# EAGLE design M882 (EAGLE 6.6.0)
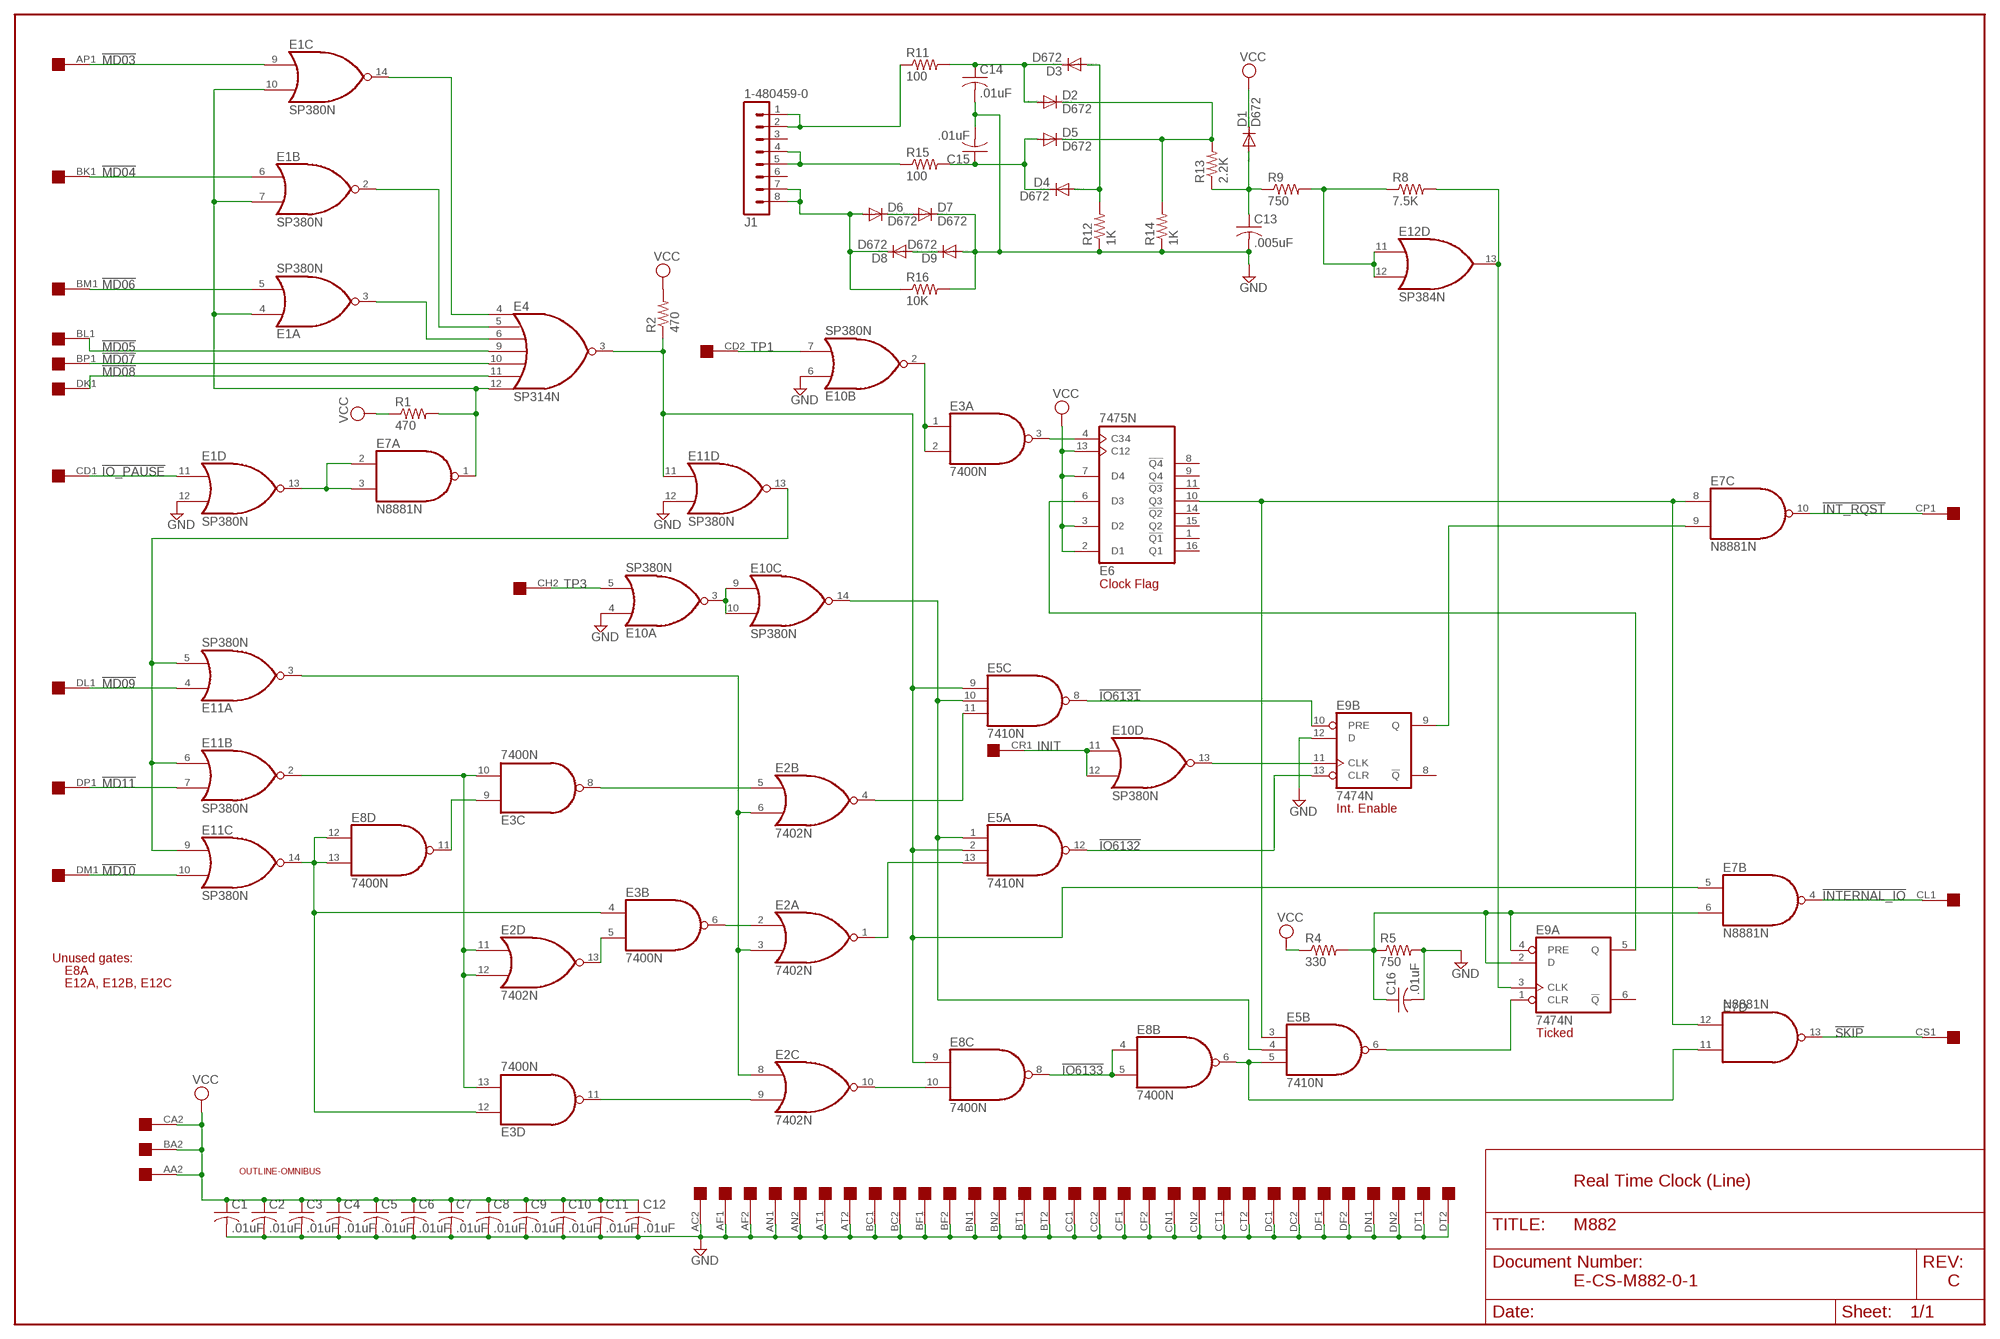
[diagram p0: schematic, sheet 1]

## Parts
C1  .01uF  C-US050-025X075  [C050-025X075]
C2  .01uF  C-US050-025X075  [C050-025X075]
C3  .01uF  C-US050-025X075  [C050-025X075]
C4  .01uF  C-US050-025X075  [C050-025X075]
C5  .01uF  C-US050-025X075  [C050-025X075]
C6  .01uF  C-US050-025X075  [C050-025X075]
C7  .01uF  C-US050-025X075  [C050-025X075]
C8  .01uF  C-US050-025X075  [C050-025X075]
C9  .01uF  C-US050-025X075  [C050-025X075]
C10  .01uF  C-US050-025X075  [C050-025X075]
C11  .01uF  C-US050-025X075  [C050-025X075]
C12  .01uF  C-US050-025X075  [C050-025X075]
C13  .005uF  C-US050-025X075  [C050-025X075]
C14  .01uF  C-US050-025X075  [C050-025X075]
C15  .01uF  C-US050-025X075  [C050-025X075]
C16  .01uF  C-US050-025X075  [C050-025X075]
D1  D672  1N4148DO35-10  [DO35-10]
D2  D672  1N4148DO35-10  [DO35-10]
D3  D672  1N4148DO35-10  [DO35-10]
D4  D672  1N4148DO35-10  [DO35-10]
D5  D672  1N4148DO35-10  [DO35-10]
D6  D672  1N4148DO35-10  [DO35-10]
D7  D672  1N4148DO35-10  [DO35-10]
D8  D672  1N4148DO35-10  [DO35-10]
D9  D672  1N4148DO35-10  [DO35-10]
E1  SP380N  [DIL14]
E2  7402N  [DIL14]
E3  7400N  [DIL14]
E4  SP314N  [DIL14]
E5  7410N  [DIL14]
E6  7475N  [DIL16]
E7  N8881N  [DIL14]
E8  7400N  [DIL14]
E9  7474N  74S74N  [DIL14]
E10  SP380N  [DIL14]
E11  SP380N  [DIL14]
E12  SP384N  [DIL14]
EDGE  QUAD  [EDGE-CON8]
J1  1-480459-0  [1-480459-0]
R1  470  R-US_0207/10  [0207/10]
R2  470  R-US_0207/10  [0207/10]
R4  330  R-US_0207/10  [0207/10]
R5  750  R-US_0207/10  [0207/10]
R8  7.5K  R-US_0207/10  [0207/10]
R9  750  R-US_0207/10  [0207/10]
R11  100  R-US_0207/10  [0207/10]
R12  1K  R-US_0207/10  [0207/10]
R13  2.2K  R-US_0207/10  [0207/10]
R14  1K  R-US_0207/10  [0207/10]
R15  100  R-US_0207/10  [0207/10]
R16  10K  R-US_0207/10  [0207/10]
U$1  OUTLINE-OMNIBUS  [OMNIBUS]

## Nets
!BIOPAUSE: E1.4(A:I0) E1.7(B:I1) E1.10(C:I1) E4.12(I6) E7.1(A:O) R1.2
!DO_CLSK: E5.6(B:O) E9.1(A:CLR)
!INIT: E9.11(B:CLK) E10.13(D:O)
!INT_RQST: E7.10(C:O) EDGE.CP1
!INTERNAL_IO: E7.4(B:O) EDGE.CL1
!IO6131: E5.8(C:O) E9.10(B:PRE)
!IO6132: E5.12(A:O) E9.13(B:CLR)
!IO6133: E8.4(B:I0) E8.5(B:I1) E8.8(C:O)
!IO_PAUSE: E1.11(D:I0) EDGE.CD1
!MAYBE_CLEI: E2.5(B:I0) E3.8(C:O)
!MAYBE_CLSK: E2.9(C:I1) E3.11(D:O)
!MAYBECLDI: E2.2(A:I0) E3.6(B:O)
!MD03: E1.9(C:I0) EDGE.AP1
!MD04: E1.6(B:I0) EDGE.BK1
!MD05: E4.9(I3) EDGE.BL1
!MD06: E1.5(A:I1) EDGE.BM1
!MD07: E4.10(I4) EDGE.BP1
!MD08: E4.11(I5) EDGE.DK1
!MD09: E11.4(A:I0) EDGE.DL1
!MD10: E11.10(C:I1) EDGE.DM1
!MD11: E11.7(B:I1) EDGE.DP1
!MYIOT: E11.5(A:I1) E11.6(B:I0) E11.9(C:I0) E11.13(D:O)
!MYMD10: E3.9(C:I0) E8.11(D:O)
!MYMD11: E2.13(D:O) E3.5(B:I1)
!SKIP: E7.13(D:O) EDGE.CS1
!TP1: E3.1(A:I0) E3.2(A:I1) E10.2(B:O)
!TP3: E10.3(A:O) E10.9(C:I0) E10.10(C:I1)
+3V3: C16.1 E7.6(B:I1) E9.2(A:D) E9.4(A:PRE) R4.2 R5.1
BOSCIN: E9.3(A:CLK) E12.13(D:O) R8.2
BTP1: E3.3(A:O) E6.4(C34)
BTP3: E5.1(A:I0) E5.4(B:I1) E5.10(C:I1) E10.14(C:O)
CK_FLAG: E5.3(B:I0) E6.10(Q3) E7.8(C:I0) E7.12(D:I1)
CLDI: E2.1(A:O) E5.13(A:I2)
CLIE: E2.4(B:O) E5.11(C:I2)
CLSK: E2.10(C:O) E8.10(C:I1)
GND: C1.2 C2.2 C3.2 C4.2 C5.2 C6.2 C7.2 C8.2 C9.2 C10.2 C11.2 C12.2 C13.2 C14.2 C15.2 C16.2 D7.C D9.A E1.12(D:I1) E9.12(B:D) E10.4(A:I0) E10.6(B:I0) E11.12(D:I1) EDGE.AC2 EDGE.AF1 EDGE.AF2 EDGE.AN1 EDGE.AN2 EDGE.AT1 EDGE.AT2 EDGE.BC1 EDGE.BC2 EDGE.BF1 EDGE.BF2 EDGE.BN1 EDGE.BN2 EDGE.BT1 EDGE.BT2 EDGE.CC1 EDGE.CC2 EDGE.CF1 EDGE.CF2 EDGE.CN1 EDGE.CN2 EDGE.CT1 EDGE.CT2 EDGE.DC1 EDGE.DC2 EDGE.DF1 EDGE.DF2 EDGE.DN1 EDGE.DN2 EDGE.DT1 EDGE.DT2 R5.2 R12.1 R14.1 R16.2
INIT: E10.11(D:I0) E10.12(D:I1) EDGE.CR1
IO6133: E5.5(B:I2) E7.11(D:I0) E8.6(B:O)
IO_PAUSE: E1.13(D:O) E7.2(A:I0) E7.3(A:I1)
IOPMD03: E1.14(C:O) E4.4(I0)
IOPMD04: E1.2(B:O) E4.5(I1)
IOPMD06: E1.3(A:O) E4.6(I2)
IRQ_ENABLE: E7.9(C:I1) E9.9(B:Q)
MYIOT: E4.3(O) E5.2(A:I1) E5.9(C:I0) E7.5(B:I0) E8.9(C:I0) E11.11(D:I0) R2.1
MYMD09: E2.3(A:I1) E2.6(B:I1) E2.8(C:I0) E11.3(A:O)
MYMD10: E3.4(B:I0) E3.12(D:I0) E8.12(D:I0) E8.13(D:I1) E11.14(C:O)
MYMD11: E2.11(D:I0) E2.12(D:I1) E3.10(C:I1) E3.13(D:I1) E11.2(B:O)
N$9: J1.1 J1.2 R11.1
N$12: J1.4 J1.5 R15.1
N$20: D6.A D8.C J1.7 J1.8 R16.1
N$48: D6.C D7.A
N$52: D8.A D9.C
N$55: D2.C D5.C R13.2 R14.2
N$56: C14.1 D2.A D3.C R11.2
N$57: D3.A D4.A R12.2
N$58: C13.1 D1.A R9.1 R13.1
N$62: C15.1 D4.C D5.A R15.2
OSCIN: E12.11(D:I0) E12.12(D:I1) R8.1 R9.2
TICKED: E6.6(D3) E9.5(A:Q)
TP1: E10.7(B:I1) EDGE.CD2
TP3: E10.5(A:I1) EDGE.CH2
VCC: C1.1 C2.1 C3.1 C4.1 C5.1 C6.1 C7.1 C8.1 C9.1 C10.1 C11.1 C12.1 D1.C E6.2(D1) E6.3(D2) E6.7(D4) E6.13(C12) EDGE.AA2 EDGE.BA2 EDGE.CA2 R1.1 R2.2 R4.1
Unconnected: E6.1(!Q1) E6.8(!Q4) E6.9(Q4) E6.11(!Q3) E6.14(!Q2) E6.15(Q2) E6.16(Q1) E8.1(A:I0) E8.2(A:I1) E8.3(A:O) E9.6(A:!Q) E9.8(B:!Q) E12.2(B:O) E12.3(A:O) E12.4(A:I0) E12.5(A:I1) E12.6(B:I0) E12.7(B:I1) E12.9(C:I0) E12.10(C:I1) E12.14(C:O) EDGE.AA1 EDGE.AB1 EDGE.AB2 EDGE.AC1 EDGE.AD1 EDGE.AD2 EDGE.AE1 EDGE.AE2 EDGE.AH1 EDGE.AH2 EDGE.AJ1 EDGE.AJ2 EDGE.AK1 EDGE.AK2 EDGE.AL1 EDGE.AL2 EDGE.AM1 EDGE.AM2 EDGE.AP2 EDGE.AR1 EDGE.AR2 EDGE.AS1 EDGE.AS2 EDGE.AU1 EDGE.AU2 EDGE.AV1 EDGE.AV2 EDGE.BA1 EDGE.BB1 EDGE.BB2 EDGE.BD1 EDGE.BD2 EDGE.BE1 EDGE.BE2 EDGE.BH1 EDGE.BH2 EDGE.BJ1 EDGE.BJ2 EDGE.BK2 EDGE.BL2 EDGE.BM2 EDGE.BP2 EDGE.BR1 EDGE.BR2 EDGE.BS1 EDGE.BS2 EDGE.BU1 EDGE.BU2 EDGE.BV1 EDGE.BV2 EDGE.CA1 EDGE.CB1 EDGE.CB2 EDGE.CE1 EDGE.CE2 EDGE.CH1 EDGE.CJ1 EDGE.CJ2 EDGE.CK1 EDGE.CK2 EDGE.CL2 EDGE.CM1 EDGE.CM2 EDGE.CP2 EDGE.CR2 EDGE.CS2 EDGE.CU1 EDGE.CU2 EDGE.CV1 EDGE.CV2 EDGE.DA1 EDGE.DA2 EDGE.DB1 EDGE.DB2 EDGE.DD1 EDGE.DD2 EDGE.DE1 EDGE.DE2 EDGE.DH1 EDGE.DH2 EDGE.DJ1 EDGE.DJ2 EDGE.DK2 EDGE.DL2 EDGE.DM2 EDGE.DP2 EDGE.DR1 EDGE.DR2 EDGE.DS1 EDGE.DS2 EDGE.DU1 EDGE.DU2 EDGE.DV1 EDGE.DV2 J1.3 J1.6

## Notes on the sheet
- Clock Flag
- Int. Enable
- Unused gates:
- E8A
- E12A, E12B, E12C
- Ticked
- Real Time Clock (Line)
- E-CS-M882-0-1 | C

## Power pins joined to a net without a drawn wire
GND: E1.1(P:GND) E2.7(P:GND) E3.7(P:GND) E4.1(GND) E5.7(P:GND) E6.12(GND) E7.7(P:GND) E8.7(P:GND) E9.7(P:GND) E10.1(P:GND) E11.1(P:GND) E12.1(GND)
VCC: E1.8(P:VCC) E2.14(P:VCC) E3.14(P:VCC) E4.8(VCC) E5.14(P:VCC) E6.5(VCC) E7.14(P:VCC) E8.14(P:VCC) E9.14(P:VCC) E10.8(P:VCC) E11.8(P:VCC) E12.8(VCC)

## Library data of the parts
C1-C16 = rcl:C-US: CAPACITOR, American symbol
D1-D9 = diode:1N4148: DIODE high speed (Philips)
E1 E10 E11 = dec-con:SP380: Quad NOR gate (use 8640)
E2 = 74xx-us:74*02: Quad 2-input NOR gate
E3 E8 = 74xx-us:74*00: Quad 2-input NAND gate
E4 = dec-con:SP314: 7-Input NOR gate
E5 = 74xx-us:74*10: Triple 3-input NAND gate
E6 = 74xx-us:74*75: 4-bit bistable LATCH
E7 = dec-con:N8881: Quad 2-input NAND gate, open collector
E9 = 74xx-us:74*74: Dual D type positive edge triggered FLIP FLOP, preset and clear
E12 = dec-con:SP384: Quad OR gate
EDGE = dec-con:QUAD: Quad-Height DEC board
J1 = dec-con:1-480459-0: Mate-N-Lok 1-480459-0, board mounted.
R1 R2 R4 R5 R8 R9 R11-R16 = rcl:R-US_: RESISTOR, American symbol
U$1 = dec-con:OUTLINE-*: Board outlines for DEC boards.

## Net classes
0 default: width 0.813 mm

## Board
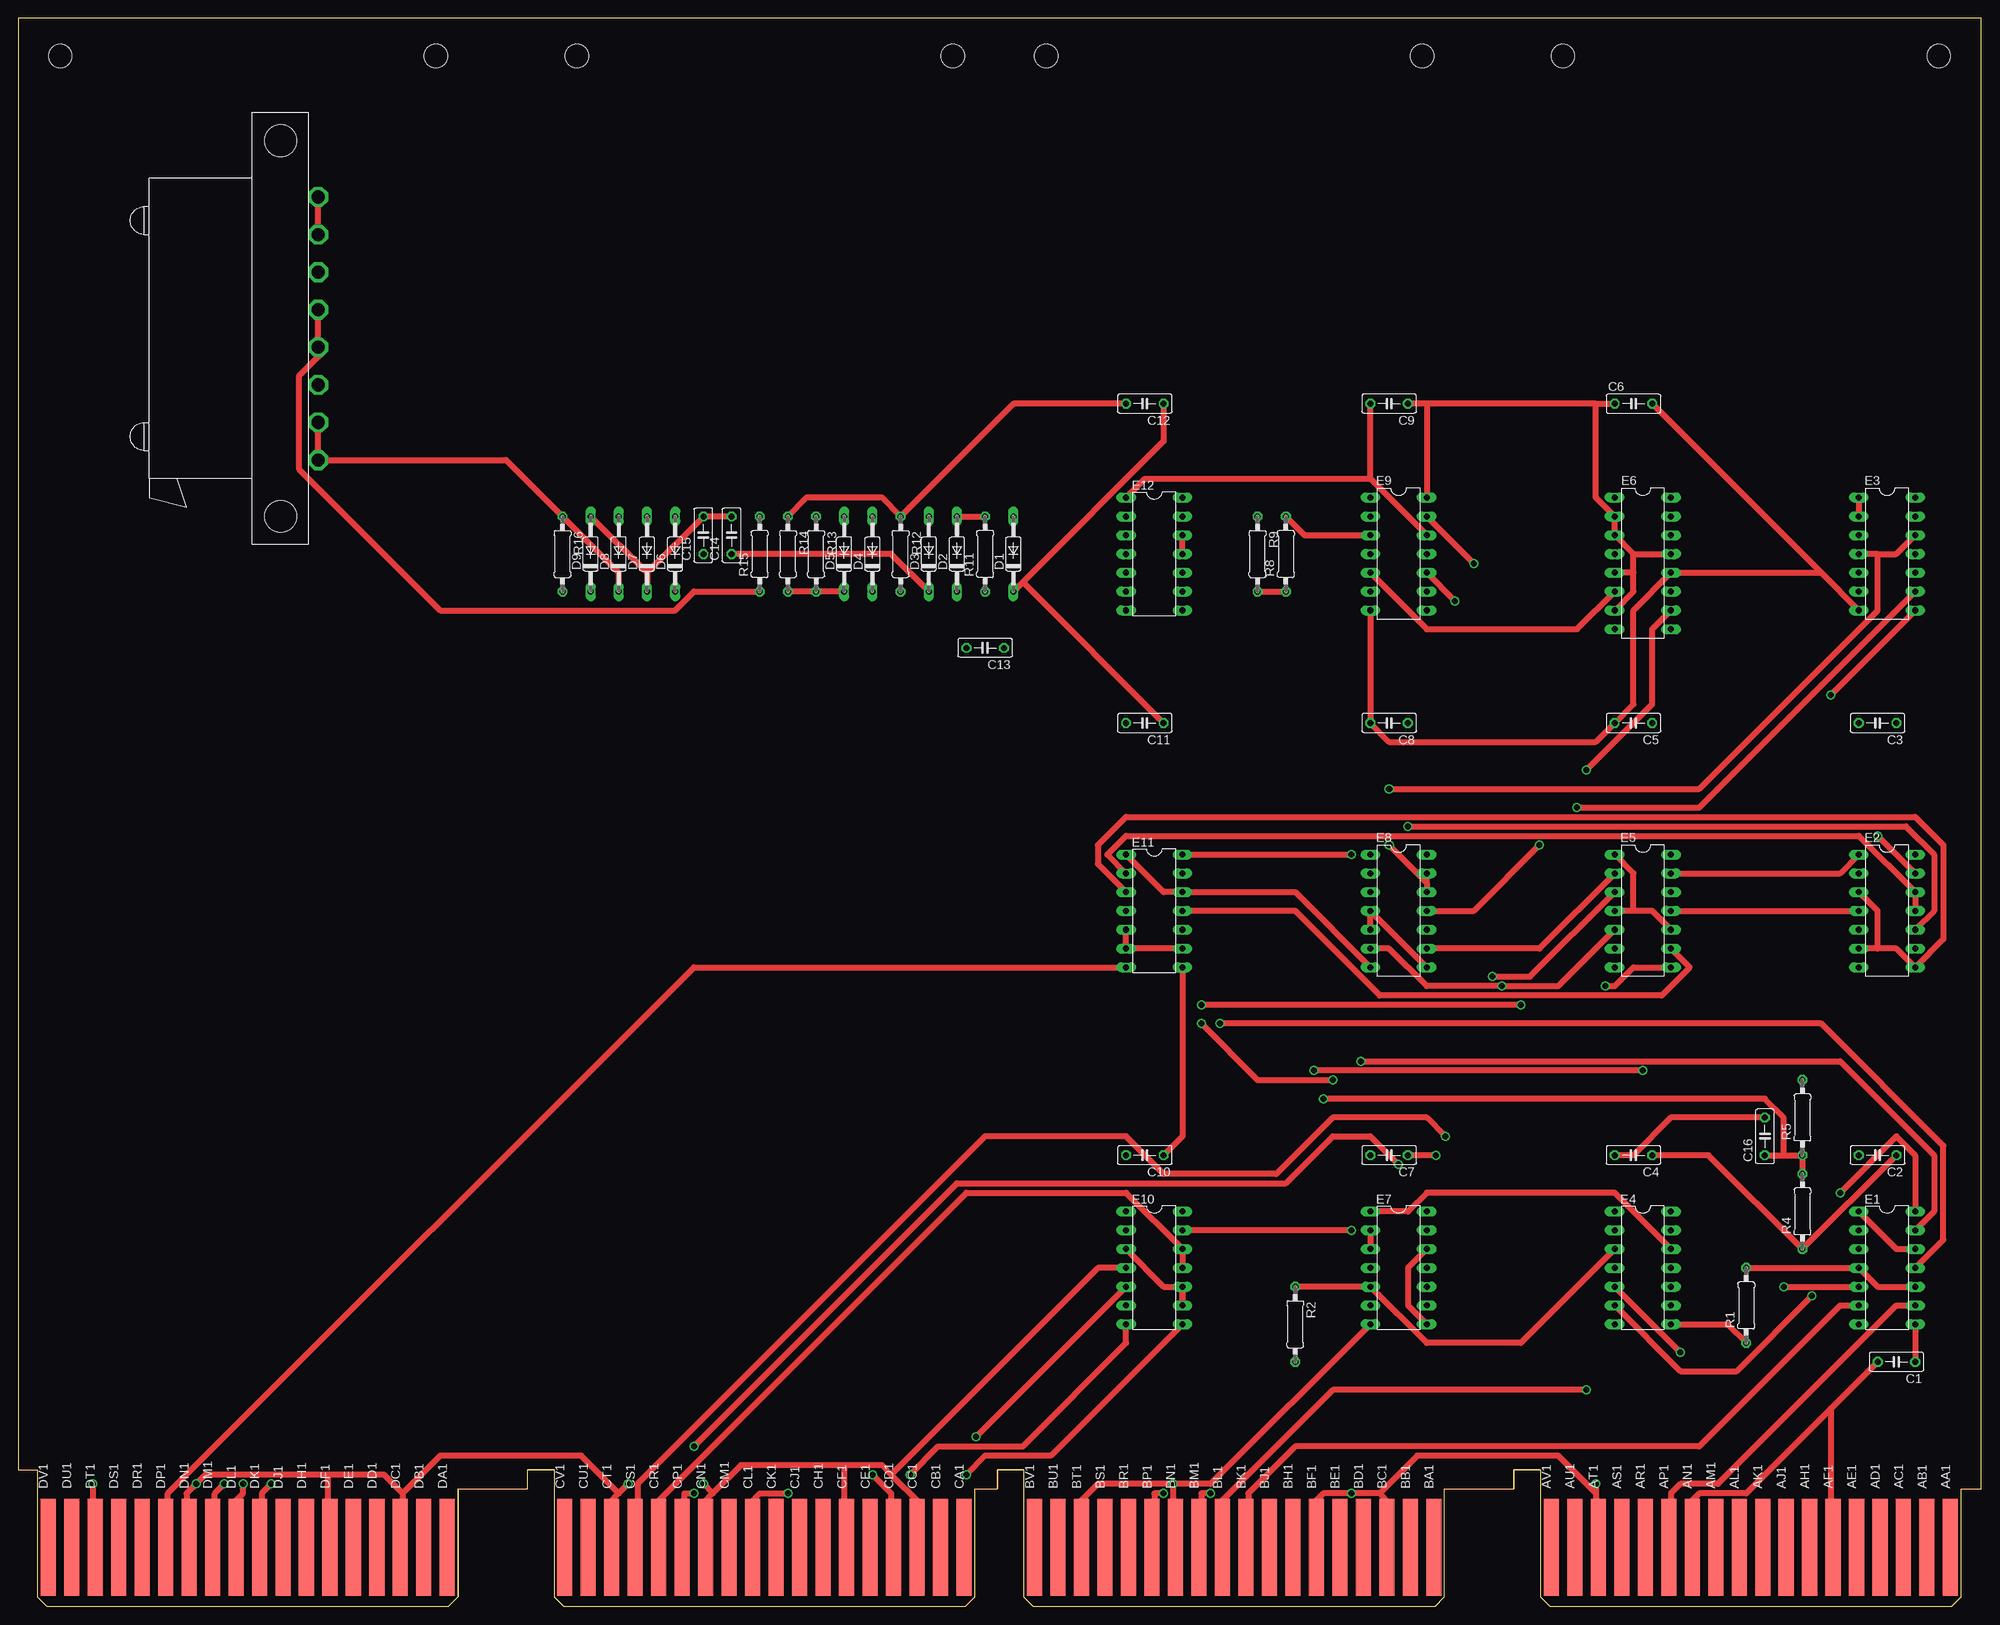
[diagram p1: board, top side]
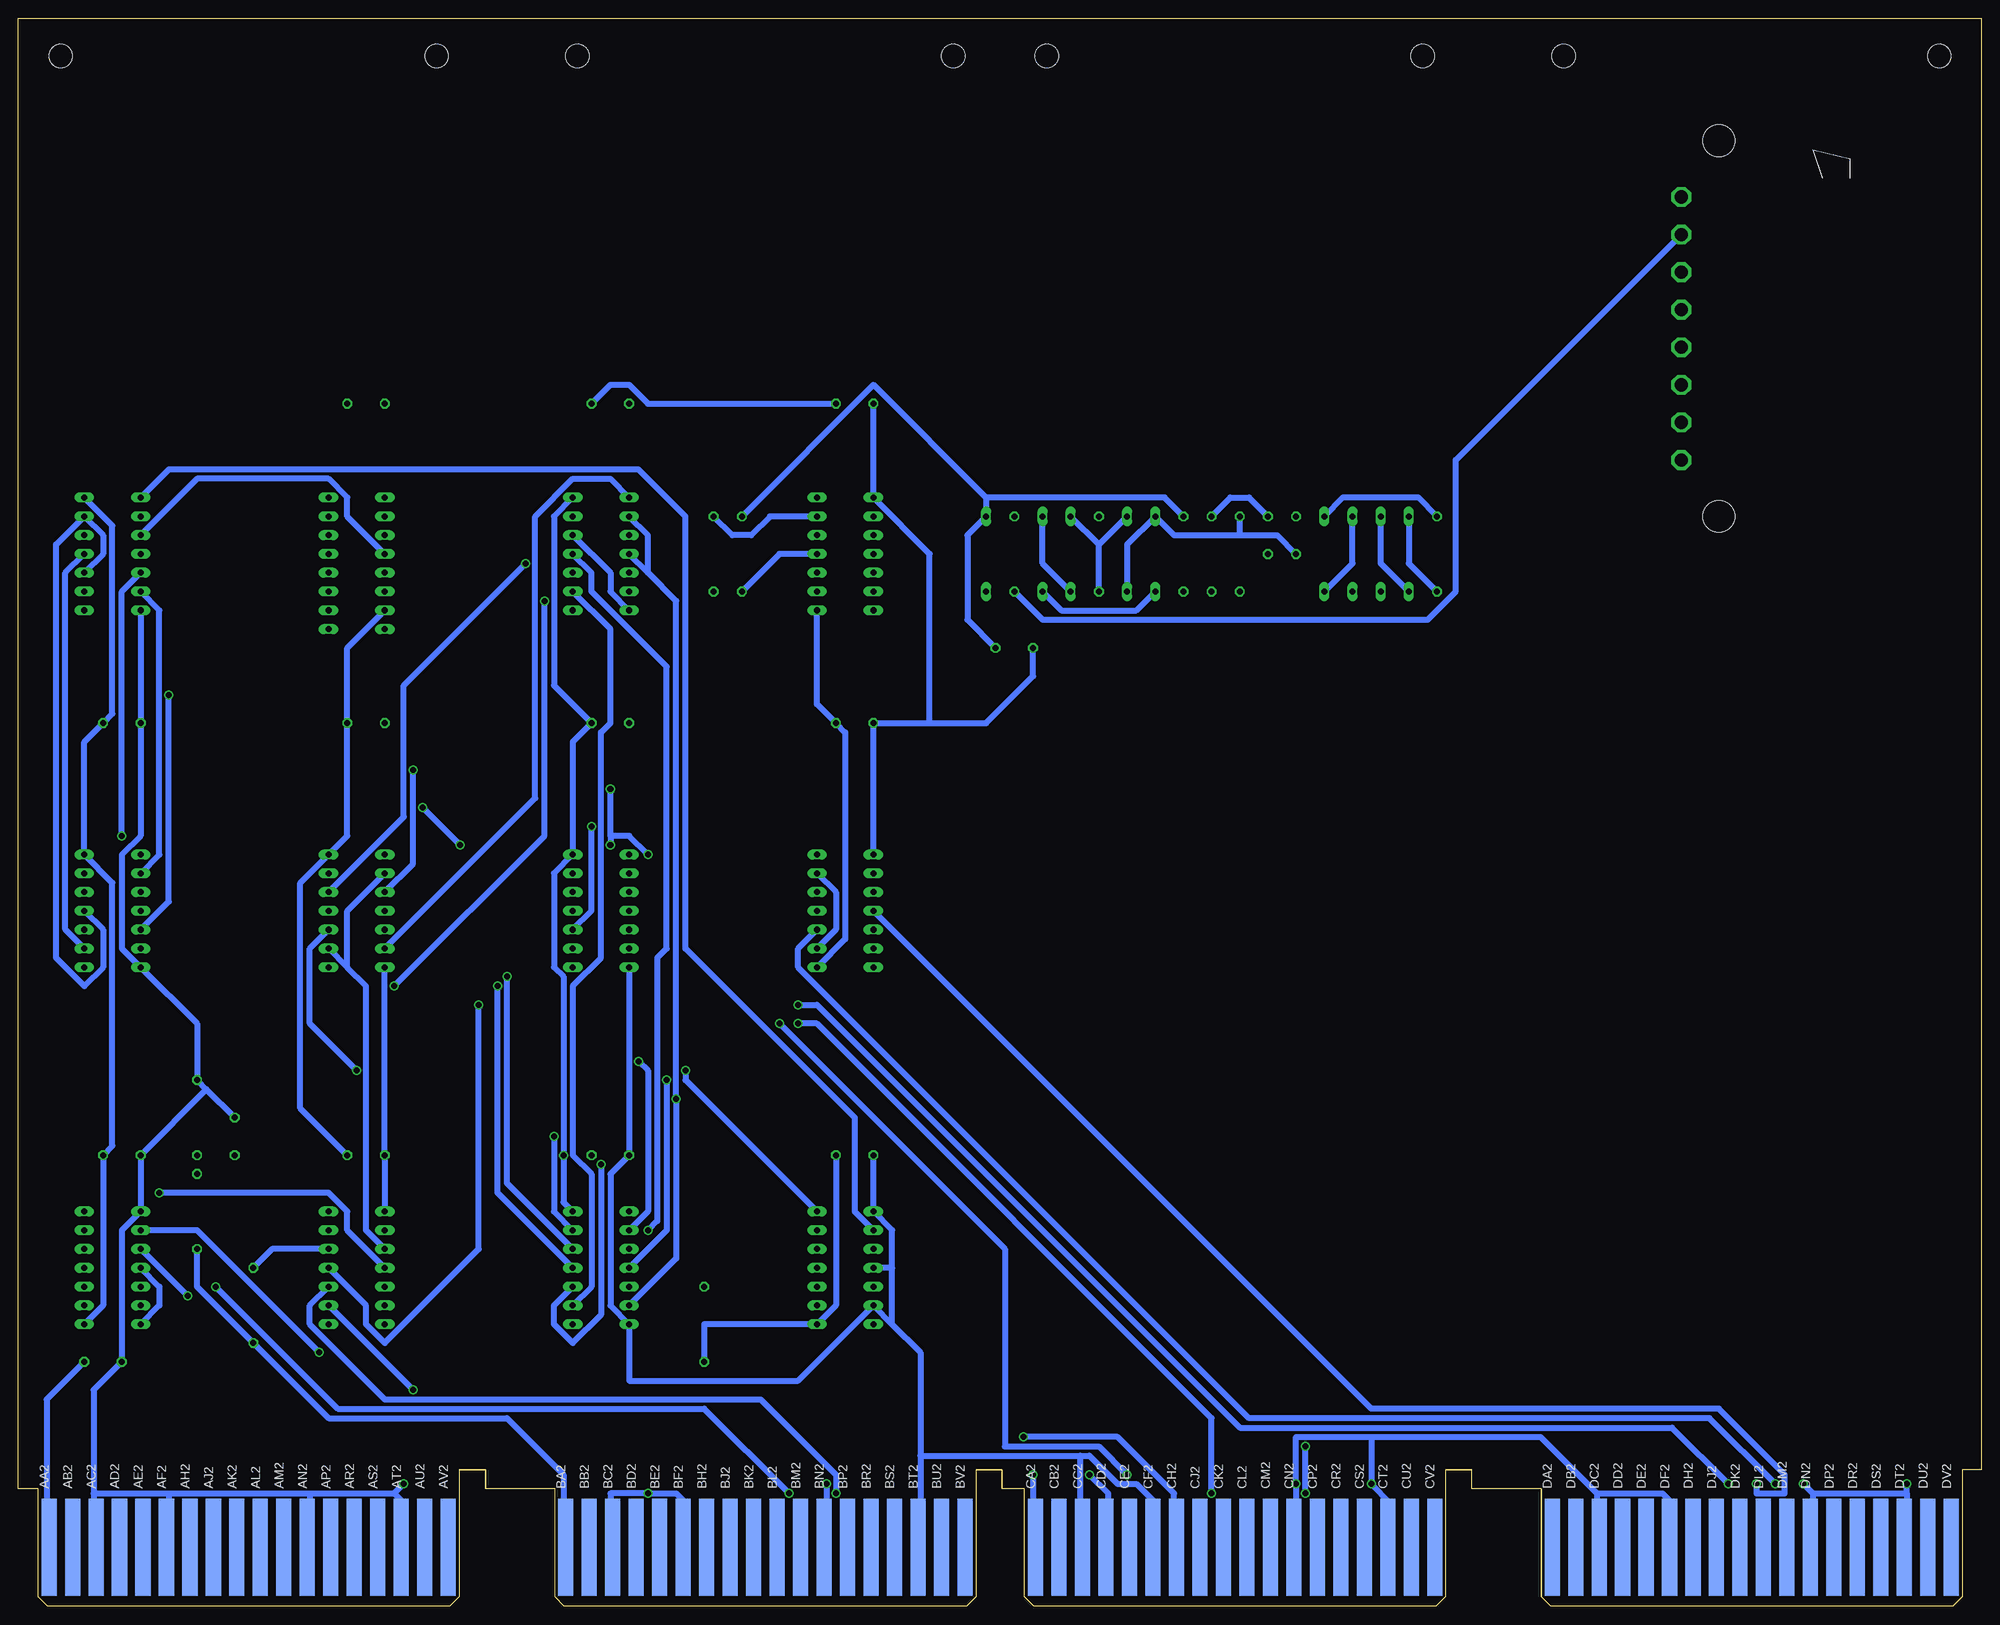
[diagram p2: board, bottom side, seen from below]

Size 265.3 x 214.63 mm. Coordinates in mm from the lower left corner, seen from the top.
Copper layers (1+16): Top 0.035mm / dielectric 1.5mm / Bottom 0.035mm
Design rules "16mils": minimum track width 16mil, minimum drill 32mil, track to track 15mil, track to pad 10mil, pad to pad 10mil, via to via 10mil, smd to smd 10mil, copper to edge 13mil, drill to drill 10mil, minimum pad ring 10mil, minimum via ring 8mil, stop-mask expansion 0mil, vias tented up to drill 0mil, thermal gap 10mil

### Footprints (pad centres in the part's own frame; a part is rotated, then mirrored left to right if it is on the bottom)
C050-025X075 = drill 0.813 octagon: 1 -2.54,0; 2 2.54,0
DO35-10 = drill 0.813 long: A 5.08,0; C -5.08,0
DIL14 = drill 0.813 long: 1 -7.62,-3.81; 2 -5.08,-3.81; 3 -2.54,-3.81; 4 0,-3.81; 5 2.54,-3.81; 6 5.08,-3.81; 7 7.62,-3.81; 8 7.62,3.81; 9 5.08,3.81; 10 2.54,3.81; 11 0,3.81; 12 -2.54,3.81; 13 -5.08,3.81; 14 -7.62,3.81
DIL16 = drill 0.813 long: 1 -8.89,-3.81; 2 -6.35,-3.81; 3 -3.81,-3.81; 4 -1.27,-3.81; 5 1.27,-3.81; 6 3.81,-3.81; 7 6.35,-3.81; 8 8.89,-3.81; 9 8.89,3.81; 10 6.35,3.81; 11 3.81,3.81; 12 1.27,3.81; 13 -1.27,3.81; 14 -3.81,3.81; 15 -6.35,3.81; 16 -8.89,3.81
EDGE-CON8 = smd 2.032 x 13.106: AA1 261.303,7.938; AB1 258.127,7.938; AC1 254.952,7.938; AD1 251.778,7.938; AE1 248.602,7.938; AF1 245.428,7.938; AH1 242.252,7.938; AJ1 239.077,7.938; AK1 235.903,7.938; AL1 232.727,7.938; AM1 229.553,7.938; AN1 226.377,7.938; AP1 223.202,7.938; AR1 220.028,7.938; AS1 216.852,7.938; AT1 213.678,7.938; AU1 210.502,7.938; AV1 207.327,7.938; BA1 191.452,7.938; BB1 188.278,7.938; BC1 185.102,7.938; BD1 181.928,7.938; BE1 178.752,7.938; BF1 175.577,7.938; BH1 172.403,7.938; BJ1 169.227,7.938; BK1 166.053,7.938; BL1 162.877,7.938; BM1 159.702,7.938; BN1 156.528,7.938; BP1 153.352,7.938; BR1 150.178,7.938; BS1 147.002,7.938; BT1 143.827,7.938; BU1 140.653,7.938; BV1 137.477,7.938; CA1 127.953,7.938; CB1 124.778,7.938; CC1 121.603,7.938; CD1 118.427,7.938; CE1 115.252,7.938; CF1 112.078,7.938; CH1 108.903,7.938; CJ1 105.728,7.938; CK1 102.552,7.938; CL1 99.377,7.938; CM1 96.203,7.938; CN1 93.028,7.938; CP1 89.853,7.938; CR1 86.677,7.938; CS1 83.502,7.938; CT1 80.328,7.938; CU1 77.153,7.938; CV1 73.978,7.938; DA1 58.102,7.938; DB1 54.928,7.938; DC1 51.752,7.938; DD1 48.578,7.938; DE1 45.403,7.938; DF1 42.227,7.938; DH1 39.053,7.938; DJ1 35.877,7.938; DK1 32.703,7.938; DL1 29.527,7.938; DM1 26.352,7.938; DN1 23.177,7.938; DP1 20.003,7.938; DR1 16.828,7.938; DS1 13.652,7.938; DT1 10.477,7.938; DU1 7.303,7.938; DV1 4.128,7.938 | smd 2.032 x 13.106 bottom: AA2 261.303,7.938; AB2 258.127,7.938; AC2 254.952,7.938; AD2 251.778,7.938; AE2 248.602,7.938; AF2 245.428,7.938; AH2 242.252,7.938; AJ2 239.077,7.938; AK2 235.903,7.938; AL2 232.727,7.938; AM2 229.553,7.938; AN2 226.377,7.938; AP2 223.202,7.938; AR2 220.028,7.938; AS2 216.852,7.938; AT2 213.678,7.938; AU2 210.502,7.938; AV2 207.327,7.938; BA2 191.452,7.938; BB2 188.278,7.938; BC2 185.102,7.938; BD2 181.928,7.938; BE2 178.752,7.938; BF2 175.577,7.938; BH2 172.403,7.938; BJ2 169.227,7.938; BK2 166.053,7.938; BL2 162.877,7.938; BM2 159.702,7.938; BN2 156.528,7.938; BP2 153.352,7.938; BR2 150.178,7.938; BS2 147.002,7.938; BT2 143.827,7.938; BU2 140.653,7.938; BV2 137.477,7.938; CA2 127.953,7.938; CB2 124.778,7.938; CC2 121.603,7.938; CD2 118.427,7.938; CE2 115.252,7.938; CF2 112.078,7.938; CH2 108.903,7.938; CJ2 105.728,7.938; CK2 102.552,7.938; CL2 99.377,7.938; CM2 96.203,7.938; CN2 93.028,7.938; CP2 89.853,7.938; CR2 86.677,7.938; CS2 83.502,7.938; CT2 80.328,7.938; CU2 77.153,7.938; CV2 73.978,7.938; DA2 58.102,7.938; DB2 54.928,7.938; DC2 51.752,7.938; DD2 48.578,7.938; DE2 45.403,7.938; DF2 42.227,7.938; DH2 39.053,7.938; DJ2 35.877,7.938; DK2 32.703,7.938; DL2 29.527,7.938; DM2 26.352,7.938; DN2 23.177,7.938; DP2 20.003,7.938; DR2 16.828,7.938; DS2 13.652,7.938; DT2 10.477,7.938; DU2 7.303,7.938; DV2 4.128,7.938
1-480459-0 = drill 1.778 octagon: 1 46.99,-1.27; 2 41.91,-1.27; 3 36.83,-1.27; 4 31.75,-1.27; 5 26.67,-1.27; 6 21.59,-1.27; 7 16.51,-1.27; 8 11.43,-1.27 | hole 4.318: 3.81,3.81; 54.61,3.81
0207/10 = drill 0.813 octagon: 1 -5.08,0; 2 5.08,0
OMNIBUS = hole 3.175: 208.915,209.55; 259.715,209.55; 189.865,209.55; 139.065,209.55; 75.616,209.55; 126.416,209.55; 56.566,209.55; 5.766,209.55

### Placement (x,y rotation side)
C1  253.87,33.02 180 top
C2  251.33,60.96 180 top
C3  251.33,119.38 180 top
C4  218.31,60.96 180 top
C5  218.31,119.38 180 top
C6  218.31,162.56 0 top
C7  185.29,60.96 180 top
C8  185.29,119.38 180 top
C9  185.29,162.56 180 top
C10  152.27,60.96 180 top
C11  152.27,119.38 180 top
C12  152.27,162.56 180 top
C13  130.68,129.54 180 top
C14  96.39,144.78 90 top
C15  92.58,144.78 90 top
C16  236.09,63.5 90 top
D1  134.49,142.24 90 top
D2  126.87,142.24 90 top
D3  123.06,142.24 90 top
D4  115.44,142.24 90 top
D5  111.63,142.24 90 top
D6  88.77,142.24 90 top
D7  84.96,142.24 90 top
D8  81.15,142.24 90 top
D9  77.34,142.24 90 top
E1  252.6,45.72 270 top
E2  252.6,93.98 270 top
E3  252.6,142.24 270 top
E4  219.58,45.72 270 top
E5  219.58,93.98 270 top
E6  219.58,140.97 270 top
E7  186.56,45.72 270 top
E8  186.56,93.98 270 top
E9  186.56,142.24 270 top
E10  153.54,45.72 270 top
E11  153.54,93.98 270 top
E12  153.54,142.24 270 top
EDGE  -0.13,0 0 top
J1  39.24,143.51 90 top
R1  233.55,40.64 90 top
R2  172.59,38.1 270 top
R4  241.17,53.34 90 top
R5  241.17,66.04 90 top
R8  171.32,142.24 90 top
R9  167.51,142.24 270 top
R11  130.68,142.24 90 top
R12  119.25,142.24 270 top
R13  107.82,142.24 270 top
R14  104.01,142.24 270 top
R15  100.2,142.24 90 top
R16  73.53,142.24 270 top
U$1  -0.13,0 0 top

### Tracks (layer width: path | path; a pad name or v marks a point on that pad's centre or on a via)
!BIOPAUSE
  Top 0.813: E1.10 251.33,43.18 E1.4 R1.2 | E7.1 187.83,53.34 190.37,55.88 215.77,55.88 E4.12
  Bottom 0.813: E1.7 246.25,40.64 246.25,43.18 E1.4 | E4.12 231.01,48.26 R1.2
!DO_CLSK
  Bottom 0.813: E5.6 195.45,109.22 195.45,147.32 190.37,152.4 185.29,152.4 E9.1
!INIT  (via drill 0.81)
  Top 0.813: v180.21,50.8 E10.13
  Bottom 0.813: v180.21,50.8 178.94,52.07 178.94,87.63 177.67,88.9 177.67,127 187.83,137.16 187.83,139.7 E9.11
!INT_RQST  (via drill 0.81)
  Top 0.813: v186.56,59.69 182.75,63.5 177.67,63.5 171.32,57.15 126.87,57.15 v91.31,21.59 | v91.31,15.24 90.04,15.24 90.04,13.97 EDGE.CP1
  Bottom 0.813: E7.10 192.91,40.64 192.91,38.1 190.37,35.56 186.56,39.37 v186.56,59.69 | v91.31,15.24 v91.31,21.59
!INTERNAL_IO  (via drill 0.81)
  Top 0.813: v177.67,71.12 167.51,71.12 v159.89,78.74 | v104.01,15.24 100.2,15.24 98.93,13.97 EDGE.CL1
  Bottom 0.813: E7.4 177.67,50.8 v177.67,71.12 | v159.89,78.74 157.35,78.74 104.01,25.4 v104.01,15.24
!IO6131  (via drill 0.81)
  Top 0.813: E5.8 218.31,86.36 215.77,83.82 v214.5,83.82 | v194.18,135.89 E9.10
  Bottom 0.813: v214.5,83.82 194.18,104.14 v194.18,135.89
!IO6132  (via drill 0.81)
  Top 0.813: v196.72,140.97 E9.13
  Bottom 0.813: E5.12 213.23,106.68 213.23,124.46 v196.72,140.97
!IO6133
  Top 0.813: E8.5 E8.4 E8.8
!IO_PAUSE  (via drill 0.81)
  Top 0.813: E1.11 260.22,49.53 260.22,62.23 243.71,78.74 v162.43,78.74 | v115.44,17.78 117.98,15.24 117.98,13.97 EDGE.CD1
  Bottom 0.813: v162.43,78.74 131.95,48.26 131.95,21.59 119.25,21.59 v115.44,17.78
!MAYBE_CLEI  (via drill 0.81)
  Top 0.813: v244.98,123.19 E3.8
  Bottom 0.813: E2.5 244.98,95.25 v244.98,123.19
!MAYBE_CLSK
  Bottom 0.813: E2.9 258.95,91.44 258.95,139.7 E3.11
!MAYBECLDI
  Bottom 0.813: E2.2 246.25,101.6 246.25,134.62 E3.6
!MD03
  Top 0.813: E1.9 253.87,40.64 229.74,16.51 224.66,16.51 223.39,15.24 223.39,13.97 EDGE.AP1
!MD04
  Top 0.813: E1.6 246.25,40.64 227.2,21.59 172.59,21.59 166.24,15.24 166.24,13.97 EDGE.BK1
!MD05  (via drill 0.81)
  Top 0.813: v211.96,29.21 177.67,29.21 162.43,13.97 EDGE.BL1
  Bottom 0.813: E4.9 v211.96,29.21
!MD06  (via drill 0.81)
  Top 0.813: v238.63,43.18 E1.5 | v161.16,15.24 159.89,15.24 159.89,13.97 EDGE.BM1
  Bottom 0.813: v238.63,43.18 222.12,26.67 172.59,26.67 v161.16,15.24
!MD07  (via drill 0.81)
  Top 0.813: v154.81,15.24 153.54,15.24 153.54,13.97 EDGE.BP1
  Bottom 0.813: E4.10 225.93,40.64 225.93,38.1 215.77,27.94 164.97,27.94 154.81,17.78 v154.81,15.24
!MD08  (via drill 0.81)
  Top 0.813: v203.07,81.28 v159.89,81.28 | v34.16,16.51 32.89,15.24 32.89,13.97 EDGE.DK1
  Bottom 0.813: E4.11 218.31,40.64 218.31,38.1 215.77,35.56 203.07,48.26 v203.07,81.28 | v159.89,81.28 157.35,81.28 100.2,24.13 41.78,24.13 v34.16,16.51
!MD09  (via drill 0.81)
  Top 0.813: v30.35,16.51 30.35,15.24 29.08,13.97 EDGE.DL1
  Bottom 0.813: E11.4 82.42,26.67 35.43,26.67 26.54,17.78 26.54,15.24 30.35,15.24 v30.35,16.51
!MD10  (via drill 0.81)
  Top 0.813: v27.81,16.51 26.54,15.24 26.54,13.97 EDGE.DM1
  Bottom 0.813: E11.10 159.89,88.9 159.89,86.36 98.93,25.4 36.7,25.4 v27.81,16.51
!MD11
  Top 0.813: E11.7 91.31,86.36 20.19,15.24 20.19,13.97 EDGE.DP1
!MYIOT
  Top 0.813: E11.5 E11.6 E11.9
  Bottom 0.813: E11.13 154.81,96.52 154.81,91.44 E11.9
!MYMD10  (via drill 0.81)
  Top 0.813: E8.11 196.72,93.98 v205.61,102.87 | v210.69,107.95 227.2,107.95 E3.9
  Bottom 0.813: v205.61,102.87 v210.69,107.95
!MYMD11  (via drill 0.81)
  Top 0.813: E2.13 v251.33,104.14
  Bottom 0.813: v251.33,104.14 251.33,137.16 E3.5
!SKIP  (via drill 0.81)
  Top 0.813: v192.91,63.5 190.37,66.04 177.67,66.04 170.05,58.42 154.81,58.42 149.73,63.5 130.68,63.5 83.69,16.51 83.69,13.97 EDGE.CS1
  Bottom 0.813: E7.13 192.91,53.34 v192.91,63.5
!TP1
  Top 0.813: E3.1 E3.2
  Bottom 0.813: E10.2 152.27,53.34 152.27,66.04 175.13,88.9 175.13,147.32 181.48,153.67 244.98,153.67 E3.1
!TP3
  Top 0.813: E10.10 E10.9 E10.10 | E10.3 154.81,43.18 E10.10
+3V3  (via drill 0.81)
  Top 0.813: R4.2 R5.1 238.63,60.96 | C16.1 238.63,60.96 | 238.63,60.96 238.63,66.04 236.09,68.58 v176.4,68.58
  Bottom 0.813: E7.6 176.4,46.99 v176.4,68.58 176.4,135.89 180.21,139.7 | 180.21,139.7 E9.4 | E9.2 180.21,144.78 180.21,139.7
BOSCIN
  Top 0.813: E9.3 173.86,144.78 R8.2
  Bottom 0.813: E12.13 163.7,147.32 166.24,144.78 168.78,144.78 R8.2
BTP1
  Bottom 0.813: E6.4 220.85,147.32 220.85,149.86 223.39,152.4 241.17,152.4 E3.3
BTP3  (via drill 0.81)
  Top 0.813: v219.58,72.39 v175.13,72.39 | 218.31,93.98 220.85,93.98 E5.10 | 218.31,93.98 E5.4 | E5.1 218.31,99.06 218.31,93.98
  Bottom 0.813: E10.14 175.13,71.12 v175.13,72.39 | v219.58,72.39 225.93,78.74 225.93,88.9 E5.10
CK_FLAG  (via drill 0.81)
  Top 0.813: E7.8 187.83,40.64 187.83,45.72 E7.12 | v211.96,113.03 220.85,121.92 220.85,132.08 E6.10 | v199.26,85.09 204.34,85.09 E5.3
  Bottom 0.813: E5.3 211.96,100.33 v211.96,113.03 | E7.12 199.26,57.15 v199.26,85.09
CLDI
  Top 0.813: E5.13 246.25,99.06 E2.1
CLIE
  Top 0.813: E5.11 E2.4
CLSK  (via drill 0.81)
  Top 0.813: v187.83,105.41 255.14,105.41 258.95,101.6 258.95,93.98 E2.10
  Bottom 0.813: E8.10 187.83,93.98 v187.83,105.41
GND  (via drill 0.81)
  Top 0.813: v10.03,16.51 10.03,13.97 EDGE.DT1 | 41.78,17.78 49.4,17.78 51.94,15.24 | 41.78,17.78 25.27,17.78 v24,16.51 22.73,15.24 22.73,13.97 EDGE.DN1 | 51.94,15.24 51.94,13.97 EDGE.DC1 | 41.78,17.78 41.78,13.97 EDGE.DF1 | v82.42,16.51 81.15,15.24 | 81.15,15.24 79.88,13.97 EDGE.CT1 | 51.94,15.24 57.02,20.32 76.07,20.32 81.15,15.24 | 93.85,15.24 97.66,19.05 111.63,19.05 | 93.85,15.24 92.58,13.97 EDGE.CN1 | 111.63,19.05 116.71,19.05 117.98,17.78 | 117.98,17.78 121.79,13.97 EDGE.CC1 | 111.63,19.05 111.63,13.97 EDGE.CF1 | 117.98,17.78 145.92,45.72 E10.4 | 93.85,15.24 v92.58,16.51 | E1.12 253.87,48.26 E1.1 | C4.2 218.31,60.96 223.39,66.04 C16.2 | 184.02,15.24 v180.21,15.24 176.4,15.24 175.13,13.97 EDGE.BF2 | 184.02,15.24 185.29,13.97 EDGE.BC2 | 213.23,15.24 213.23,13.97 EDGE.AT2 | 213.23,15.24 208.15,20.32 189.1,20.32 184.02,15.24 | C1.2 244.98,26.67 | 244.98,26.67 233.55,15.24 227.2,15.24 225.93,13.97 EDGE.AN2 | 244.98,26.67 244.98,13.97 EDGE.AF2 | v213.23,16.51 213.23,15.24 | v156.08,16.51 145.92,16.51 143.38,13.97 EDGE.BT1 | v156.08,16.51 156.08,13.97 EDGE.BN1 | v156.08,16.51 161.16,16.51 E7.7 | 243.71,139.7 E6.12 218.31,134.62 218.31,121.92 C5.2 213.23,116.84 185.29,116.84 C8.2 E9.7 | 243.71,139.7 E3.7 | 243.71,139.7 C6.2 | 182.75,152.4 C9.2 | 182.75,152.4 E9.12 | 84.96,139.7 D7.C | 84.96,139.7 D9.A | C14.2 C15.2 84.96,139.7 | R14.1 106.55,149.86 116.71,149.86 R12.1 134.49,162.56 C12.2 | E11.1 154.81,96.52 E11.12 172.59,96.52 E8.7 | 182.75,152.4 152.27,152.4 E12.1
  Bottom 0.813: 10.03,15.24 10.03,13.97 EDGE.DT1 | 10.03,15.24 v10.03,16.51 | 22.73,15.24 10.03,15.24 | 22.73,15.24 22.73,13.97 EDGE.DN1 | v24,16.51 22.73,15.24 | 51.94,15.24 43.05,15.24 41.78,13.97 EDGE.DF1 | 51.94,15.24 51.94,13.97 EDGE.DC1 | 87.5,22.86 82.42,22.86 v82.42,16.51 79.88,13.97 EDGE.CT1 | 87.5,22.86 92.58,22.86 v92.58,16.51 92.58,13.97 EDGE.CN1 | 51.94,15.24 59.56,22.86 87.5,22.86 | 121.79,20.32 120.52,20.32 116.71,16.51 114.17,16.51 111.63,13.97 EDGE.CF1 | 121.79,20.32 121.79,13.97 EDGE.CC1 | C10.2 E10.1 147.19,50.8 147.19,45.72 | 147.19,38.1 143.38,34.29 143.38,20.32 | 147.19,38.1 E10.6 159.89,30.48 182.75,30.48 E7.7 185.29,40.64 185.29,58.42 C7.2 E8.7 | 143.38,20.32 143.38,13.97 EDGE.BT1 | 147.19,45.72 E10.4 | 147.19,38.1 147.19,45.72 | 143.38,20.32 121.79,20.32 | E4.1 C4.2 E5.7 | 239.9,69.85 R5.2 241.17,78.74 E2.7 251.33,88.9 251.33,101.6 248.79,104.14 C3.2 E3.7 | 239.9,69.85 C16.2 | 239.9,69.85 C2.2 E1.1 251.33,50.8 C1.2 255.14,29.21 255.14,15.24 | EDGE.BF2 175.13,13.97 176.4,15.24 v180.21,15.24 185.29,15.24 185.29,13.97 EDGE.BC2 | 214.5,15.24 213.23,13.97 EDGE.AT2 | 225.93,15.24 214.5,15.24 | 225.93,15.24 225.93,13.97 EDGE.AN2 | 255.14,15.24 255.14,13.97 EDGE.AC2 | 255.14,15.24 244.98,15.24 | 244.98,15.24 244.98,13.97 EDGE.AF2 | 244.98,15.24 225.93,15.24 | 214.5,15.24 v213.23,16.51 | v156.08,16.51 156.08,13.97 EDGE.BN1 | E9.12 185.29,139.7 185.29,137.16 E9.7 | R16.2 77.34,140.97 D9.A | R14.1 101.47,149.86 98.93,149.86 C14.2 | C12.2 E12.1 142.11,142.24 142.11,119.38 | E11.1 C11.2 142.11,119.38 | 142.11,119.38 134.49,119.38 128.14,125.73 C13.2
INIT
  Top 0.813: E10.11 E10.12 149.73,55.88 128.14,55.88 86.23,13.97 EDGE.CR1
IO6133  (via drill 0.81)
  Top 0.813: E8.6 185.29,88.9 190.37,83.82 v200.53,83.82 208.15,83.82 E5.5
  Bottom 0.813: E7.11 200.53,55.88 v200.53,83.82
IO_PAUSE  (via drill 0.81)
  Top 0.813: E7.2 E7.3 | E1.13 258.95,53.34 258.95,60.96 246.25,73.66 v181.48,73.66
  Bottom 0.813: v181.48,73.66 180.21,72.39 180.21,53.34 E7.2
IOPMD03  (via drill 0.81)
  Top 0.813: v246.25,55.88 253.87,63.5 256.41,60.96 E1.14
  Bottom 0.813: E4.4 220.85,50.8 220.85,53.34 223.39,55.88 v246.25,55.88
IOPMD04  (via drill 0.81)
  Top 0.813: v224.66,34.29 E4.5
  Bottom 0.813: v224.66,34.29 241.17,50.8 E1.2
IOPMD06  (via drill 0.81)
  Top 0.813: E4.6 224.66,31.75 232.28,31.75 v242.44,41.91
  Bottom 0.813: v242.44,41.91 E1.3
IRQ_ENABLE
  Bottom 0.813: E7.9 187.83,43.18 187.83,58.42 190.37,60.96 190.37,83.82 186.56,87.63 186.56,118.11 185.29,119.38 185.29,132.08 E9.9
MYIOT
  Top 0.813: E8.9 205.61,88.9 E5.2 | R2.1 E7.5 190.37,35.56 203.07,35.56 E4.3 | E11.11 172.59,93.98 184.02,82.55 222.12,82.55 225.93,86.36 E5.9
  Bottom 0.813: E4.3 218.31,50.8 218.31,83.82 220.85,86.36 | 220.85,86.36 E5.9 | E5.2 220.85,93.98 220.85,86.36
MYMD09
  Top 0.813: E11.3 145.92,100.33 145.92,102.87 149.73,106.68 256.41,106.68 260.22,102.87 260.22,90.17 E2.8 253.87,88.9 251.33,88.9 | 251.33,88.9 E2.6 | E2.3 251.33,93.98 251.33,88.9
MYMD10  (via drill 0.81)
  Top 0.813: 251.33,142.24 253.87,142.24 E3.12 | 251.33,142.24 E3.4 | 190.37,97.79 E8.13 | 190.37,97.79 E8.12 | E11.14 v180.21,101.6 | v185.29,102.87 190.37,97.79 | 251.33,142.24 251.33,134.62 227.2,110.49 v185.29,110.49
  Bottom 0.813: v180.21,101.6 182.75,104.14 185.29,104.14 | 185.29,104.14 v185.29,102.87 | 185.29,104.14 v185.29,110.49
MYMD11
  Top 0.813: E2.11 E2.12 248.79,104.14 149.73,104.14 147.19,101.6 E11.2
  Bottom 0.813: E3.10 253.87,142.24 253.87,144.78 E3.13 260.22,143.51 260.22,87.63 256.41,83.82 253.87,86.36 253.87,91.44 E2.11
N$9
  Top 0.813: J1.2 J1.1
  Bottom 0.813: R11.1 126.87,133.35 74.8,133.35 70.99,137.16 70.99,154.94 J1.2
N$12
  Top 0.813: R15.1 91.31,137.16 88.77,134.62 57.02,134.62 37.97,153.67 37.97,166.37 40.51,168.91 J1.5 J1.4
N$20
  Top 0.813: J1.7 J1.8 65.91,154.94 R16.1 81.15,139.7 D8.C
  Bottom 0.813: D6.A 86.23,149.86 76.07,149.86 R16.1
N$48
  Bottom 0.813: D6.C 84.96,140.97 D7.A
N$52
  Bottom 0.813: D9.C 81.15,140.97 D8.A
N$55
  Top 0.813: R14.2 R13.2 D5.C
  Bottom 0.813: D2.C 124.33,134.62 114.17,134.62 D5.C
N$56
  Top 0.813: C14.1 117.98,142.24 D3.C | D2.A R11.2
  Bottom 0.813: D3.C 126.87,140.97 D2.A
N$57
  Bottom 0.813: 119.25,143.51 D4.A | 119.25,143.51 D3.A | R12.2 119.25,143.51
N$58
  Bottom 0.813: R13.1 110.36,149.86 134.49,149.86 | 134.49,149.86 D1.A 137.03,144.78 137.03,133.35 C13.1 | R9.1 149.73,165.1 134.49,149.86
N$62
  Bottom 0.813: C15.1 95.12,144.78 100.2,144.78 | 100.2,144.78 R15.2 | D4.C 115.44,143.51 D5.A 109.09,144.78 100.2,144.78
OSCIN
  Top 0.813: E12.11 E12.12 | R9.2 R8.1
  Bottom 0.813: E12.11 162.43,142.24 R9.2
TICKED
  Top 0.813: E9.5 190.37,132.08 210.69,132.08 E6.6
TP1  (via drill 0.81)
  Top 0.813: E10.7 149.73,35.56 135.76,21.59 124.33,21.59 v120.52,17.78
  Bottom 0.813: v120.52,17.78 117.98,15.24 117.98,13.97 EDGE.CD2
TP3  (via drill 0.81)
  Top 0.813: v129.41,22.86 E10.5
  Bottom 0.813: v129.41,22.86 116.71,22.86 109.09,15.24 109.09,13.97 EDGE.CH2
VCC  (via drill 0.81)
  Top 0.813: 135.76,138.43 C11.1 | C12.1 154.81,157.48 135.76,138.43 | 135.76,138.43 D1.C | E11.8 157.35,63.5 C10.1 | v128.14,17.78 130.68,20.32 139.57,20.32 E10.8 | v191.64,60.96 C7.1 | 213.23,162.56 C6.1 | 213.23,162.56 190.37,162.56 | 190.37,162.56 C9.1 | 190.37,162.56 E9.14 | 218.31,142.24 E6.13 | 218.31,137.16 218.31,142.24 | E6.7 218.31,137.16 | 218.31,137.16 218.31,139.7 E6.5 | 218.31,142.24 E6.3 E6.2 213.23,149.86 213.23,162.56 | E1.8 C1.1 | E4.8 231.01,38.1 R1.1 | C4.1 228.47,60.96 R4.1 C2.1
  Bottom 0.813: E12.8 157.35,121.92 C11.1 153.54,118.11 153.54,90.17 E11.8 | R2.2 172.59,38.1 E10.8 154.81,40.64 C10.1 | v128.14,17.78 128.14,13.97 EDGE.CA2 | E7.14 191.64,54.61 v191.64,60.96 191.64,85.09 192.91,86.36 192.91,99.06 E8.14 190.37,116.84 C8.1 192.91,124.46 192.91,147.32 E9.14 | E6.7 220.85,129.54 C5.1 220.85,104.14 E5.14 227.2,97.79 227.2,67.31 C4.1 | C1.1 261.49,27.94 261.49,13.97 EDGE.AA2 | E3.14 252.6,146.05 252.6,120.65 C3.1 256.41,116.84 E2.14 252.6,97.79 252.6,62.23 C2.1 253.87,40.64 E1.8 | R4.1 241.17,43.18 R1.1 223.39,25.4 199.26,25.4 191.64,17.78 191.64,13.97 EDGE.BA2 | C12.1 180.21,162.56 182.75,165.1 185.29,165.1 C9.1